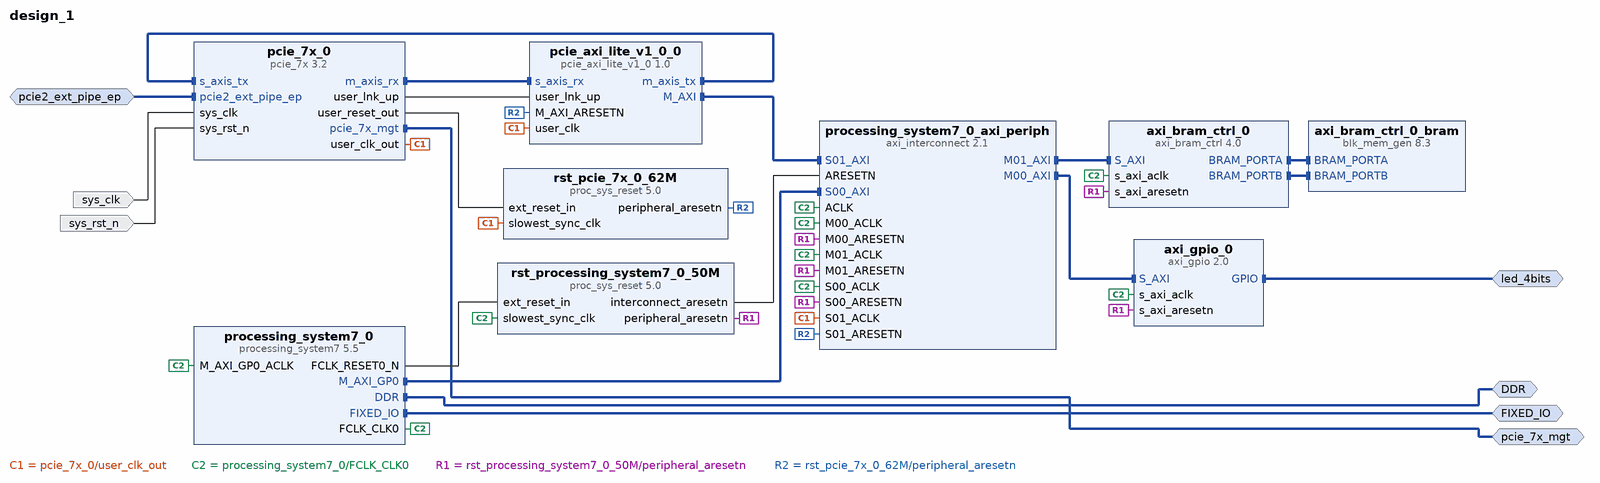
[diagram p0: block diagram of the top level]
# Vivado block design design_1, Vivado 2015.4
create_bd_design design_1

create_bd_intf_port -mode Master -vlnv xilinx.com:interface:gpio_rtl:1.0 led_4bits
create_bd_intf_port -mode Slave -vlnv xilinx.com:display_pcie_7x:pcie2_ext_pipe_rtl:1.0 pcie2_ext_pipe_ep
create_bd_intf_port -mode Master -vlnv xilinx.com:interface:ddrx_rtl:1.0 DDR
create_bd_intf_port -mode Master -vlnv xilinx.com:display_processing_system7:fixedio_rtl:1.0 FIXED_IO
create_bd_intf_port -mode Master -vlnv xilinx.com:interface:pcie_7x_mgt_rtl:1.0 pcie_7x_mgt
create_bd_port -dir I -type clk sys_clk
create_bd_port -dir I -type rst sys_rst_n

create_bd_cell -type ip -vlnv xilinx.com:ip:pcie_7x:3.2 pcie_7x_0
set_property -dict [list \
  CONFIG.mode_selection Advanced \
  CONFIG.Bar0_Size 4 \
  CONFIG.Bar1_Enabled true \
  CONFIG.Bar1_Type Memory \
  CONFIG.Bar1_Scale Kilobytes \
  CONFIG.Bar1_Size 4 \
  CONFIG.IntX_Generation false \
  CONFIG.Legacy_Interrupt NONE \
  CONFIG.MSI_Enabled false \
  CONFIG.MSIx_Table_BIR BAR_0 \
  CONFIG.MSIx_PBA_BIR BAR_0 \
  CONFIG.Xlnx_Ref_Board ZC706 \
  CONFIG.Pcie_fast_config None \
  CONFIG.PCIe_Debug_Ports false \
  CONFIG.Ref_Clk_Freq 100_MHz \
  CONFIG.RBAR_Num 0 \
  CONFIG.pipe_sim false \
  CONFIG.en_ext_clk false \
  CONFIG.pl_interface false \
  CONFIG.cfg_mgmt_if false \
  CONFIG.cfg_ctl_if false \
  CONFIG.cfg_status_if false \
  CONFIG.rcv_msg_if false \
  CONFIG.cfg_fc_if false \
  CONFIG.err_reporting_if false \
  CONFIG.en_ext_pipe_interface true \
  CONFIG.pipe_mode_sim None \
] [get_bd_cells pcie_7x_0]
create_bd_cell -type ip -vlnv xilinx.com:ip:axi_gpio:2.0 axi_gpio_0
set_property -dict {CONFIG.USE_BOARD_FLOW true CONFIG.GPIO_BOARD_INTERFACE led_4bits} [get_bd_cells axi_gpio_0]
create_bd_cell -type ip -vlnv xilinx.com:ip:processing_system7:5.5 processing_system7_0
set_property -dict {CONFIG.preset ZC706} [get_bd_cells processing_system7_0]
create_bd_cell -type ip -vlnv xilinx.com:ip:axi_interconnect:2.1 processing_system7_0_axi_periph
set_property -dict {CONFIG.NUM_SI 2 CONFIG.NUM_MI 2} [get_bd_cells processing_system7_0_axi_periph]
create_bd_cell -type ip -vlnv xilinx.com:ip:proc_sys_reset:5.0 rst_processing_system7_0_50M
create_bd_cell -type ip -vlnv xilinx.com:ip:axi_bram_ctrl:4.0 axi_bram_ctrl_0
create_bd_cell -type ip -vlnv xilinx.com:ip:proc_sys_reset:5.0 rst_pcie_7x_0_62M
create_bd_cell -type ip -vlnv xilinx.com:ip:blk_mem_gen:8.3 axi_bram_ctrl_0_bram
set_property -dict {CONFIG.Memory_Type True_Dual_Port_RAM} [get_bd_cells axi_bram_ctrl_0_bram]
create_bd_cell -type ip -vlnv xilinx.com:user:pcie_axi_lite_v1_0:1.0 pcie_axi_lite_v1_0_0
set_property -dict [list \
  CONFIG.C_DATA_WIDTH 64 \
  CONFIG.AXI_BAR_0_ADDR 0x40000000 \
  CONFIG.AXI_BAR_0_MASK 0xFFFFF000 \
  CONFIG.AXI_BAR_1_ADDR 0x41200000 \
  CONFIG.AXI_BAR_1_MASK 0xFFFFF000 \
] [get_bd_cells pcie_axi_lite_v1_0_0]

# ---- connections ----

connect_bd_intf_net [get_bd_intf_pins processing_system7_0/M_AXI_GP0] [get_bd_intf_pins processing_system7_0_axi_periph/S00_AXI]
connect_bd_intf_net [get_bd_intf_pins processing_system7_0_axi_periph/M00_AXI] [get_bd_intf_pins axi_gpio_0/S_AXI]
connect_bd_intf_net [get_bd_intf_pins processing_system7_0_axi_periph/M01_AXI] [get_bd_intf_pins axi_bram_ctrl_0/S_AXI]
connect_bd_intf_net [get_bd_intf_pins axi_bram_ctrl_0_bram/BRAM_PORTA] [get_bd_intf_pins axi_bram_ctrl_0/BRAM_PORTA]
connect_bd_intf_net [get_bd_intf_pins axi_bram_ctrl_0_bram/BRAM_PORTB] [get_bd_intf_pins axi_bram_ctrl_0/BRAM_PORTB]
connect_bd_intf_net [get_bd_intf_pins pcie_7x_0/m_axis_rx] [get_bd_intf_pins pcie_axi_lite_v1_0_0/s_axis_rx]
connect_bd_intf_net [get_bd_intf_pins pcie_axi_lite_v1_0_0/m_axis_tx] [get_bd_intf_pins pcie_7x_0/s_axis_tx]
connect_bd_intf_net [get_bd_intf_pins pcie_axi_lite_v1_0_0/M_AXI] [get_bd_intf_pins processing_system7_0_axi_periph/S01_AXI]
connect_bd_intf_net [get_bd_intf_ports led_4bits] [get_bd_intf_pins axi_gpio_0/GPIO]
connect_bd_intf_net [get_bd_intf_ports pcie2_ext_pipe_ep] [get_bd_intf_pins pcie_7x_0/pcie2_ext_pipe_ep]
connect_bd_intf_net [get_bd_intf_ports DDR] [get_bd_intf_pins processing_system7_0/DDR]
connect_bd_intf_net [get_bd_intf_ports FIXED_IO] [get_bd_intf_pins processing_system7_0/FIXED_IO]
connect_bd_intf_net [get_bd_intf_ports pcie_7x_mgt] [get_bd_intf_pins pcie_7x_0/pcie_7x_mgt]
connect_bd_net [get_bd_ports sys_clk] [get_bd_pins pcie_7x_0/sys_clk]
connect_bd_net [get_bd_ports sys_rst_n] [get_bd_pins pcie_7x_0/sys_rst_n]
connect_bd_net [get_bd_pins pcie_7x_0/user_clk_out] \
  [get_bd_pins rst_pcie_7x_0_62M/slowest_sync_clk] [get_bd_pins pcie_axi_lite_v1_0_0/user_clk] \
  [get_bd_pins processing_system7_0_axi_periph/S01_ACLK]
connect_bd_net [get_bd_pins processing_system7_0/FCLK_CLK0] \
  [get_bd_pins processing_system7_0/M_AXI_GP0_ACLK] [get_bd_pins rst_processing_system7_0_50M/slowest_sync_clk] \
  [get_bd_pins axi_gpio_0/s_axi_aclk] [get_bd_pins axi_bram_ctrl_0/s_axi_aclk] \
  [get_bd_pins processing_system7_0_axi_periph/ACLK] [get_bd_pins processing_system7_0_axi_periph/M00_ACLK] \
  [get_bd_pins processing_system7_0_axi_periph/M01_ACLK] [get_bd_pins processing_system7_0_axi_periph/S00_ACLK]
connect_bd_net [get_bd_pins processing_system7_0/FCLK_RESET0_N] [get_bd_pins rst_processing_system7_0_50M/ext_reset_in]
connect_bd_net [get_bd_pins rst_processing_system7_0_50M/peripheral_aresetn] \
  [get_bd_pins axi_gpio_0/s_axi_aresetn] [get_bd_pins axi_bram_ctrl_0/s_axi_aresetn] \
  [get_bd_pins processing_system7_0_axi_periph/S00_ARESETN] [get_bd_pins processing_system7_0_axi_periph/M00_ARESETN] \
  [get_bd_pins processing_system7_0_axi_periph/M01_ARESETN]
connect_bd_net [get_bd_pins rst_processing_system7_0_50M/interconnect_aresetn] [get_bd_pins processing_system7_0_axi_periph/ARESETN]
connect_bd_net [get_bd_pins pcie_7x_0/user_reset_out] [get_bd_pins rst_pcie_7x_0_62M/ext_reset_in]
connect_bd_net [get_bd_pins rst_pcie_7x_0_62M/peripheral_aresetn] \
  [get_bd_pins pcie_axi_lite_v1_0_0/M_AXI_ARESETN] [get_bd_pins processing_system7_0_axi_periph/S01_ARESETN]
connect_bd_net [get_bd_pins pcie_7x_0/user_lnk_up] [get_bd_pins pcie_axi_lite_v1_0_0/user_lnk_up]

# ---- address map ----
assign_bd_address -offset 0x40000000 -range 8K -target_address_space [get_bd_addr_spaces pcie_axi_lite_v1_0_0/M_AXI] [get_bd_addr_segs axi_bram_ctrl_0/S_AXI/Mem0]
assign_bd_address -offset 0x41200000 -range 64K -target_address_space [get_bd_addr_spaces pcie_axi_lite_v1_0_0/M_AXI] [get_bd_addr_segs axi_gpio_0/S_AXI/Reg]
assign_bd_address -offset 0x40000000 -range 8K -target_address_space [get_bd_addr_spaces processing_system7_0/Data] [get_bd_addr_segs axi_bram_ctrl_0/S_AXI/Mem0]
assign_bd_address -offset 0x41200000 -range 64K -target_address_space [get_bd_addr_spaces processing_system7_0/Data] [get_bd_addr_segs axi_gpio_0/S_AXI/Reg]

validate_bd_design
save_bd_design
